# Altium schematic sheet IRIS1-DLB.SchDoc
size A3; SheetNumber: 1; SheetTotal: 1
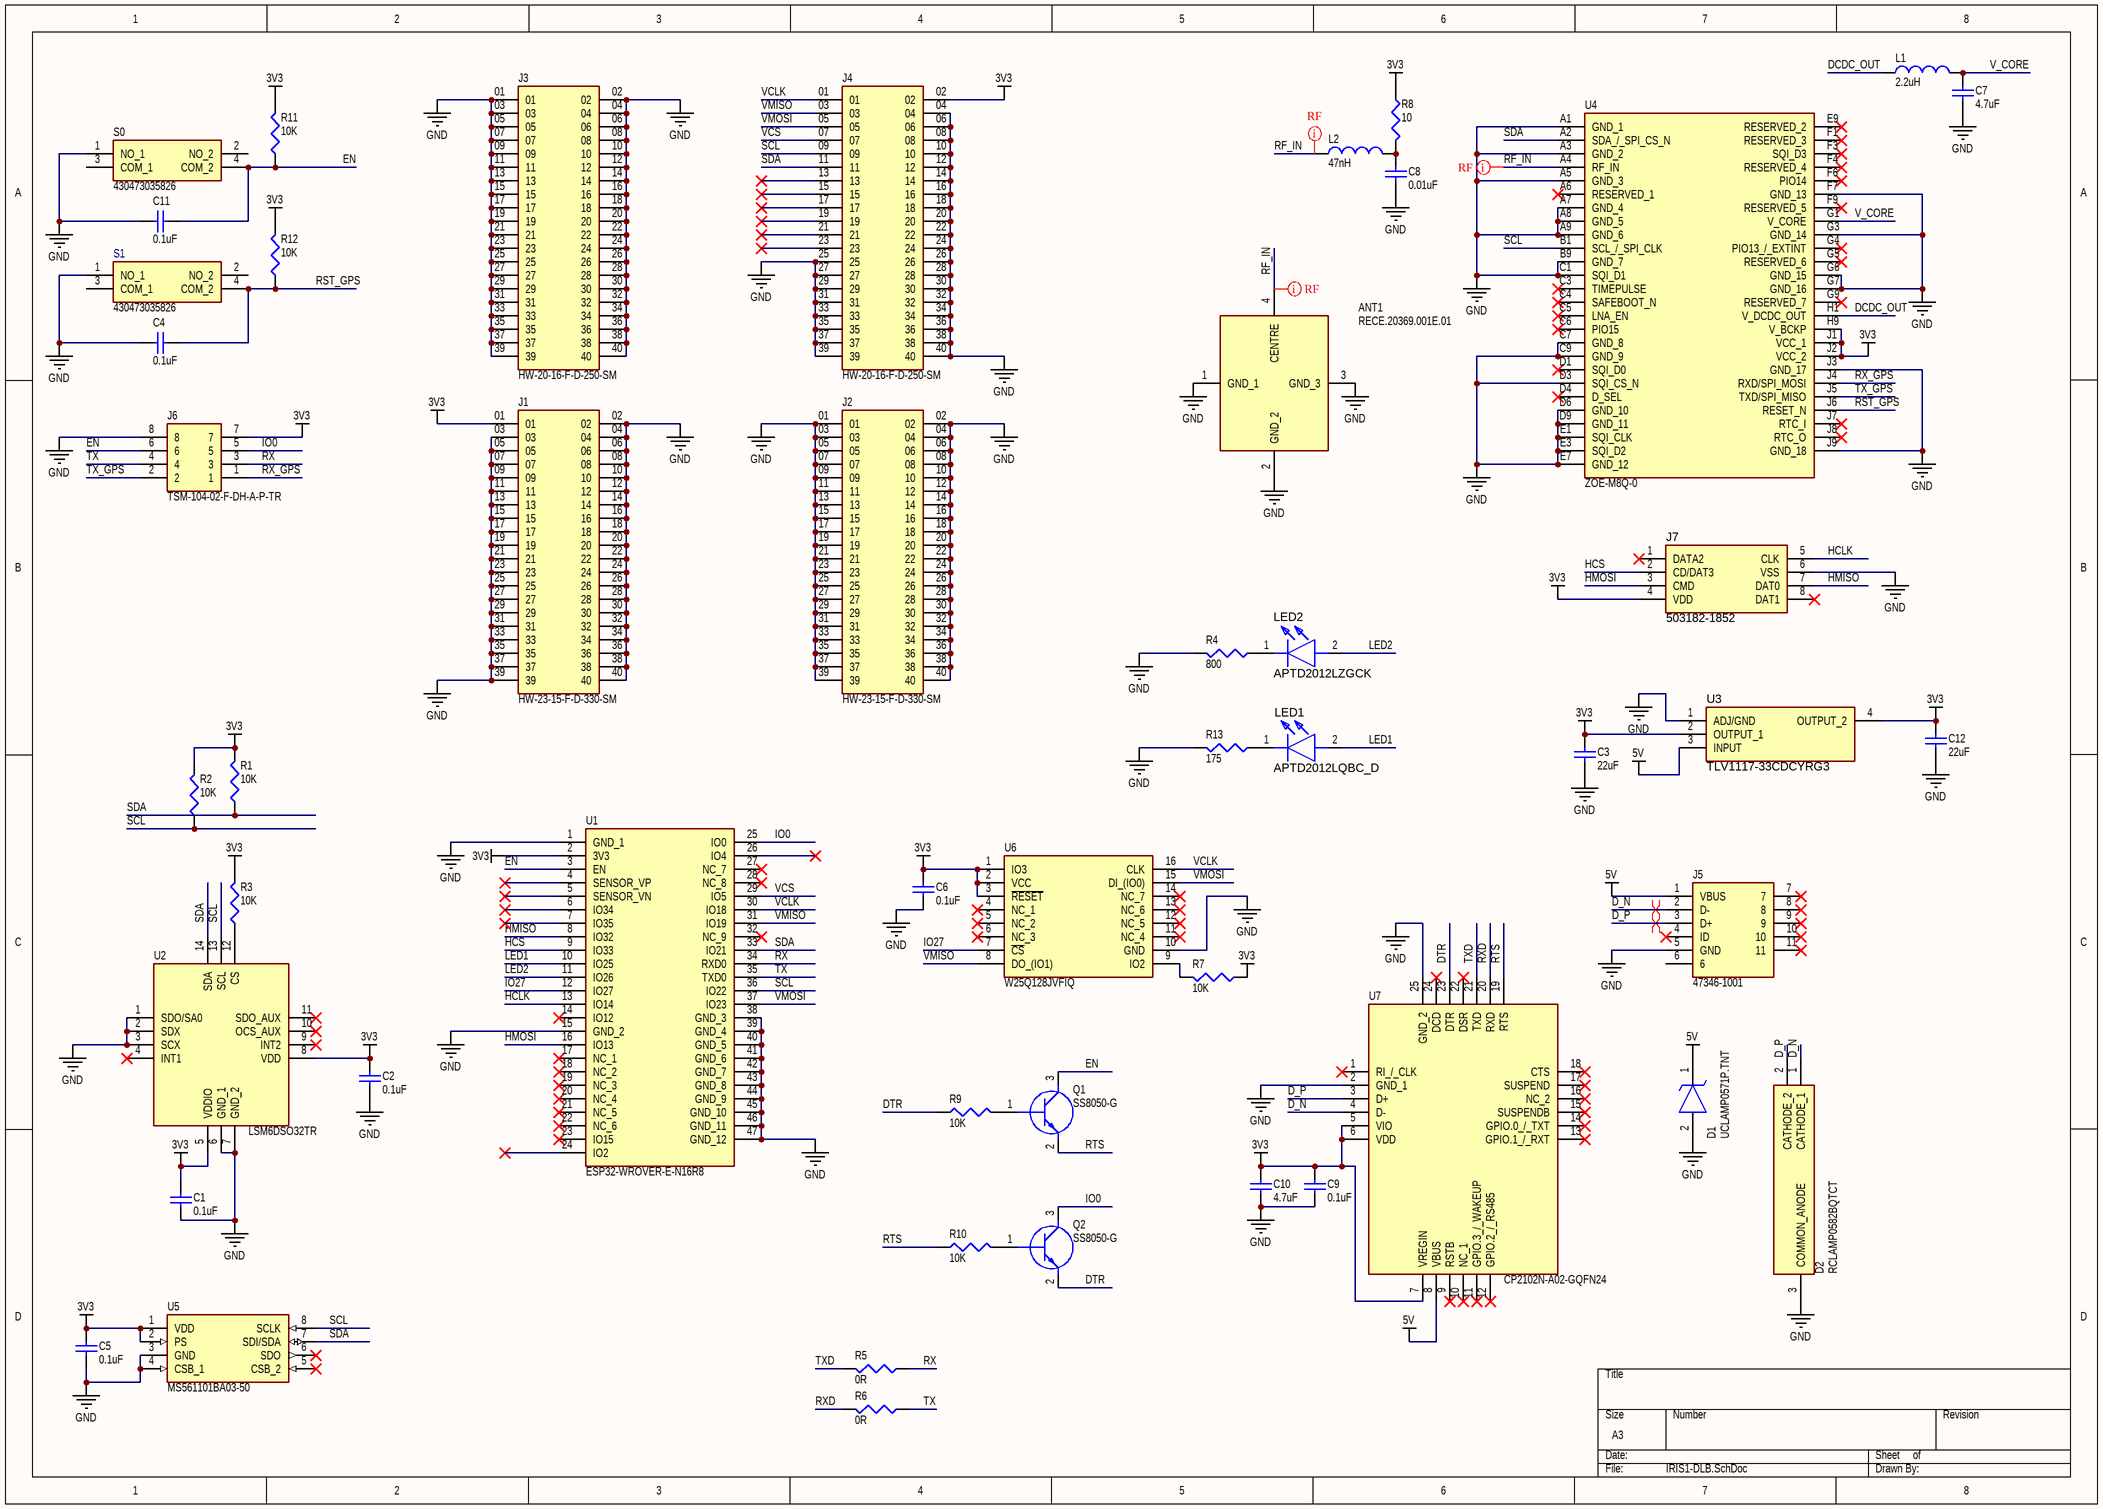
[diagram p0: IRIS1-DLB.SchDoc]

## Parts
ANT1  RECE.20369.001E.01  [RECE20369001E01]
C1  0.1uF  [1608[0603]]
C2  0.1uF  [1608[0603]]
C3  22uF  [1608[0603]]
C4  0.1uF  [1608[0603]]
C5  0.1uF  [1608[0603]]
C6  0.1uF  [1608[0603]]
C7  4.7uF  [1608[0603]]
C8  0.01uF  [1608[0603]]
C9  0.1uF  [1608[0603]]
C10  4.7uF  [1608[0603]]
C11  0.1uF  [1608[0603]]
C12  22uF  [1608[0603]]
D1  UCLAMP0571P.TNT  [DIOC1610X55N]
D2  RCLAMP0582BQTCT  [SOT50P160X90-3N]
J1  HW-23-15-F-D-330-SM  [SAMTEC_HW-20-16-F-D-250-SM]
J2  HW-23-15-F-D-330-SM  [SAMTEC_HW-20-16-F-D-250-SM]
J3  HW-20-16-F-D-250-SM  [SAMTEC_HW-20-16-F-D-250-SM]
J4  HW-20-16-F-D-250-SM  [SAMTEC_HW-20-16-F-D-250-SM]
J5  47346-1001  [473461001]
J6  TSM-104-02-F-DH-A-P-TR  [TSM-104-ZZ-YYY-DH-A-P-TR]
J7  503182-1852  [5031821852]
L1  2.2uH  [0402-A]
L2  47nH  [0402-A]
LED1  APTD2012LQBC_D  [LEDC2012X120N]
LED2  APTD2012LZGCK  [LEDC2012X105N]
Q1  SS8050-G  [SOT95P240X115-3N]
Q2  SS8050-G  [SOT95P240X115-3N]
R1  10K  [J1-0603]
R2  10K  [J1-0603]
R3  10K  [J1-0603]
R4  800  [J1-0603]
R5  0R  [J1-0603]
R6  0R  [J1-0603]
R7  10K  [J1-0603]
R8  10  [J1-0603]
R9  10K  [J1-0603]
R10  10K  [J1-0603]
R11  10K  [J1-0603]
R12  10K  [J1-0603]
R13  175  [J1-0603]
S0  430473035826  [430473035826]
S1  430473035826  [430473035826]
U1  ESP32-WROVER-E-N16R8  [ESP32WROVEREN16R8]
U2  LSM6DSO32TR  [LGA-14(2.5X3X0.86)]
U3  TLV1117-33CDCYRG3  [SOT230P700X180-4N]
U4  ZOE-M8Q-0  [ZOEM8Q0]
U5  MS561101BA03-50  [MS561101BA03-50]
U6  W25Q128JVFIQ  [SOIC127P1032X264-16N]
U7  CP2102N-A02-GQFN24  [QFN50P400X400X80-25N-D]

## Nets
3V3: C1.2 C2.2 C3.2 C5.2 C6.2 C9.2 C10.2 C12.2 J1.01 J4.02 J6.7 J7.4(VDD) R1.2 R2.2 R3.2 R7.1 R8.1 R11.2 R12.2 U1.2(3V3) U2.5(VDDIO) U2.8(VDD) U3.2(OUTPUT_1) U3.4(OUTPUT_2) U4.H9(V_BCKP) U4.J1(VCC_1) U4.J2(VCC_2) U5.1(VDD) U5.2(PS) U6.1(IO3) U6.2(VCC) U6.3(~{RESET}) U7.5(VIO) U7.6(VDD) U7.7(VREGIN)
5V: D1.1(K) J5.1(VBUS) U3.3(INPUT) U7.8(VBUS)
GND: ANT1.1(GND_1) ANT1.2(GND_2) ANT1.3(GND_3) C1.1 C2.1 C3.1 C4.1 C5.1 C6.1 C7.1 C8.1 C9.1 C10.1 C11.1 C12.1 D1.2(A) D2.3(COMMON_ANODE) J1.02 J1.03 J1.04 J1.05 J1.06 J1.07 J1.08 J1.09 J1.10 J1.11 J1.12 J1.13 J1.14 J1.15 J1.16 J1.17 J1.18 J1.19 J1.20 J1.21 J1.22 J1.23 J1.24 J1.25 J1.26 J1.27 J1.28 J1.29 J1.30 J1.31 J1.32 J1.33 J1.34 J1.35 J1.36 J1.37 J1.38 J1.39 J1.40 J2.01 J2.02 J2.03 J2.04 J2.05 J2.06 J2.07 J2.08 J2.09 J2.10 J2.11 J2.12 J2.13 J2.14 J2.15 J2.16 J2.17 J2.18 J2.19 J2.20 J2.21 J2.22 J2.23 J2.24 J2.25 J2.26 J2.27 J2.28 J2.29 J2.30 J2.31 J2.32 J2.33 J2.34 J2.35 J2.36 J2.37 J2.38 J2.39 J2.40 J3.01 J3.02 J3.03 J3.04 J3.05 J3.06 J3.07 J3.08 J3.09 J3.10 J3.11 J3.12 J3.13 J3.14 J3.15 J3.16 J3.17 J3.18 J3.19 J3.20 J3.21 J3.22 J3.23 J3.24 J3.25 J3.26 J3.27 J3.28 J3.29 J3.30 J3.31 J3.32 J3.33 J3.34 J3.35 J3.36 J3.37 J3.38 J3.39 J3.40 J4.04 J4.06 J4.08 J4.10 J4.12 J4.14 J4.16 J4.18 J4.20 J4.22 J4.24 J4.25 J4.26 J4.27 J4.28 J4.29 J4.30 J4.31 J4.32 J4.33 J4.34 J4.35 J4.36 J4.37 J4.38 J4.39 J4.40 J5.5(GND) J6.8 J7.6(VSS) R4.2 R13.2 S0.1(NO_1) S1.1(NO_1) U1.1(GND_1) U1.15(GND_2) U1.38(GND_3) U1.39(GND_4) U1.40(GND_5) U1.41(GND_6) U1.42(GND_7) U1.43(GND_8) U1.44(GND_9) U1.45(GND_10) U1.46(GND_11) U1.47(GND_12) U2.1(SDO/SA0) U2.2(SDX) U2.3(SCX) U2.6(GND_1) U2.7(GND_2) U3.1(ADJ/GND) U4.A1(GND_1) U4.A3(GND_2) U4.A5(GND_3) U4.A7(GND_4) U4.A8(GND_5) U4.A9(GND_6) U4.B9(GND_7) U4.C1(SQI_D1) U4.C7(GND_8) U4.C9(GND_9) U4.D3(SQI_CS_N) U4.D6(GND_10) U4.D9(GND_11) U4.E1(SQI_CLK) U4.E3(SQI_D2) U4.E7(GND_12) U4.F7(GND_13) U4.G3(GND_14) U4.G6(GND_15) U4.G7(GND_16) U4.J3(GND_17) U4.J9(GND_18) U5.3(GND) U5.4(CSB_1) U6.10(GND) U7.2(GND_1) U7.25(GND_2)
D_N: D2.1(CATHODE_1) J5.2(D-) U7.4(D-)
D_P: D2.2(CATHODE_2) J5.3(D+) U7.3(D+)
DCDC_OUT: L1.1 U4.H1(V_DCDC_OUT)
DTR: Q2.2(E) R9.1 U7.23(DTR)
EN: C11.2 J6.6 Q1.3(C) R11.1 S0.4(COM_2) U1.3(EN)
HCLK: J7.5(CLK) U1.13(IO14)
HCS: J7.2(CD/DAT3) U1.9(IO33)
HMISO: J7.7(DAT0) U1.8(IO32)
HMOSI: J7.3(CMD) U1.16(IO13)
IO0: J6.5 Q2.3(C) U1.25(IO0)
IO27: U1.12(IO27) U6.7(~{CS})
LED1: LED1.2(A) U1.10(IO25)
LED2: LED2.2(A) U1.11(IO26)
RF_IN: ANT1.4(CENTRE) L2.1 U4.A4(RF_IN)
RST_GPS: C4.2 R12.1 S1.4(COM_2) U4.J6(RESET_N)
RTS: Q1.2(E) R10.1 U7.19(RTS)
RX: J6.3 R5.1 U1.34(RXD0)
RX_GPS: J6.1 U4.J4(RXD/SPI_MOSI)
RXD: R6.2 U7.20(RXD)
SCL: J4.09 R2.1 U1.36(IO22) U2.13(SCL) U4.B1(SCL_/_SPI_CLK) U5.8(SCLK)
SDA: J4.11 R1.1 U1.33(IO21) U2.14(SDA) U4.A2(SDA_/_SPI_CS_N) U5.7(SDI/SDA)
TX: J6.4 R6.1 U1.35(TXD0)
TX_GPS: J6.2 U4.J5(TXD/SPI_MISO)
TXD: R5.2 U7.21(TXD)
V_CORE: C7.2 L1.2 U4.G1(V_CORE)
VCLK: J4.01 U1.30(IO18) U6.16(CLK)
VCS: J4.07 U1.29(IO5)
VMISO: J4.03 U1.31(IO19) U6.8(DO_(IO1))
VMOSI: J4.05 U1.37(IO23) U6.15(DI_(IO0))
NetC8_2: C8.2 L2.2 R8.2
NetLED1_1: LED1.1(K) R13.1
NetLED2_1: LED2.1(K) R4.1
NetQ1_1: Q1.1(B) R9.2
NetQ2_1: Q2.1(B) R10.2
NetR3_1: R3.1 U2.12(CS)
NetR7_2: R7.2 U6.9(IO2)

Not connected (* = marked no-connect by the designer): J4 13* 15* 17* 19* 21* 23*; J5 4(ID)* 6 7* 8* 9* 10* 11*; J7 1(DATA2)* 8(DAT1)*; S0 2(NO_2) 3(COM_1); S1 2(NO_2) 3(COM_1); U1 4(SENSOR_VP)* 5(SENSOR_VN)* 6(IO34)* 7(IO35)* 14(IO12)* 17(NC_1)* 18(NC_2)* 19(NC_3)* 20(NC_4)* 21(NC_5)* 22(NC_6)* 23(IO15)* 24(IO2)* 26(IO4)* 27(NC_7)* 28(NC_8)* 32(NC_9)*; U2 4(INT1)* 9(INT2)* 10(OCS_AUX)* 11(SDO_AUX)*; U4 A6(RESERVED_1)* C3(TIMEPULSE)* C4(SAFEBOOT_N)* C5(LNA_EN)* C6(PIO15)* D1(SQI_D0)* D4(D_SEL)* E9(RESERVED_2)* F1(RESERVED_3)* F3(SQI_D3)* F4(RESERVED_4)* F6(PIO14)* F9(RESERVED_5)* G4(PIO13_/_EXTINT)* G5(RESERVED_6)* G9(RESERVED_7)* J7(RTC_I)* J8(RTC_O)*; U5 5(CSB_2)* 6(SDO)*; U6 4(NC_1)* 5(NC_2)* 6(NC_3)* 11(NC_4)* 12(NC_5)* 13(NC_6)* 14(NC_7)*; U7 1(RI_/_CLK)* 9(RSTB)* 10(NC_1)* 11(GPIO.3_/_WAKEUP)* 12(GPIO.2_/_RS485)* 13(GPIO.1_/_RXT)* 14(GPIO.0_/_TXT)* 15(SUSPENDB)* 16(NC_2)* 17(SUSPEND)* 18(CTS)* 22(DSR)* 24(DCD)*

## Layout directives
differential pair: D_N, D_P
net class RF: RF_IN

## Library data of the parts
ANT1 = RECE.20369.001E.01: Antenna; Manufacturer_Name: Taoglas; Datasheet Link: https://cdn.taoglas.com/datasheets/RECE.20369.001E.01.pdf; Height: 1.05mm; Manufacturer_Part_Number: RECE.20369.001E.01; Mouser Part Number: 960-RECE.20369001E01; Mouser Price/Stock: https://www.mouser.co.uk/ProductDetail/Taoglas/RECE.20369.001E.01?qs=DRkmTr78QATTXEmgGw9Tjg%3D%3D
C1 C2 C4-C6 C9 C11 = Cap: Capacitor; Published: 8-Jun-2000; LatestRevisionDate: 17-Jul-2002; LatestRevisionNote: Re-released for DXP Platform.; PackageReference: RAD-0.3; Publisher: Altium Limited; PackageDescription: Radial Cap, Thru-Hole; 2 Leads; 0.3 in Pin Spacing; Value: 0.1uF
C3 C7 C8 C10 C12 = Cap: Capacitor; Value: 0.1uF; Published: 8-Jun-2000; LatestRevisionDate: 17-Jul-2002; LatestRevisionNote: Re-released for DXP Platform.; PackageReference: RAD-0.3; Publisher: Altium Limited; PackageDescription: Radial Cap, Thru-Hole; 2 Leads; 0.3 in Pin Spacing
D1 = UCLAMP0571P.TNT: TVS Diode (Uni-directional); Manufacturer_Name: SEMTECH; Datasheet Link: https://www.mouser.com/datasheet/2/761/uClampxx71P-1360280.pdf; Height: 0.55mm; Manufacturer_Part_Number: UCLAMP0571P.TNT; Mouser Part Number: 947-UCLAMP0571P.TNT; Mouser Price/Stock: https://www.mouser.co.uk/ProductDetail/Semtech/UCLAMP0571PTNT?qs=rBWM4%252BvDhIdABRCK070WwQ%3D%3D; Arrow Part Number: UCLAMP0571P.TNT; Arrow Price/Stock: https://www.arrow.com/en/products/uclamp0571p.tnt/semtech?region=europe
D2 = RCLAMP0582BQTCT: TVS Diode (Uni-directional); Manufacturer_Name: SEMTECH; Datasheet Link: https://datasheet.datasheetarchive.com/originals/distributors/Datasheets-DGA21/1852579.pdf; Height: 0.9mm; Manufacturer_Part_Number: RCLAMP0582BQTCT; Mouser Part Number: 947-RCLAMP0582BQTCT; Mouser Price/Stock: https://www.mouser.co.uk/ProductDetail/Semtech/RCLAMP0582BQTCT?qs=rBWM4%252BvDhIdyuNQteOG89g%3D%3D; Arrow Part Number: RCLAMP0582BQTCT; Arrow Price/Stock: https://www.arrow.com/en/products/rclamp0582bqtct/semtech?region=nac
J1 J2 = HW-20-XX-XX-D-XXX-XXX: MF: Samtec; MP: HW-20-08-G-D-350-100; Check_prices: https://www.snapeda.com/parts/HW-20-08-G-D-350-100/Samtec/view-part/?ref=eda; Value: *; Availability: Not in stock; Price: None; Package: None; SnapEDA_Link: https://www.snapeda.com/parts/HW-20-08-G-D-350-100/Samtec/view-part/?ref=snap
J5 = 47346-1001: Connector; Manufacturer_Name: Molex; Datasheet Link: http://www.molex.com/webdocs/datasheets/pdf/en-us/0473461001_IO_CONNECTORS.pdf; Height: 2.94mm; Manufacturer_Part_Number: 47346-1001; Mouser Part Number: 538-47346-1001; Mouser Price/Stock: https://www.mouser.co.uk/ProductDetail/Molex/47346-1001?qs=yd8XiKYcH9muPqUKe4E0Dw%3D%3D; Arrow Part Number: 47346-1001; Arrow Price/Stock: https://www.arrow.com/en/products/47346-1001/molex?region=nac
J6 = TSM-104-02-F-DH-A-P-TR: Connector; Manufacturer_Name: SAMTEC; Datasheet Link: http://suddendocs.samtec.com/prints/tsm-1xx-xx-xxx-xx-xx-xxx-xx-mkt1.pdf; Manufacturer_Part_Number: TSM-104-02-F-DH-A-P-TR
J7 = 503182-1852: Connector; Manufacturer_Name: Molex; Datasheet Link: https://www.molex.com/pdm_docs/sd/5031821852_sd.pdf; Manufacturer_Part_Number: 503182-1852; Mouser Part Number: 538-503182-1852; Mouser Price/Stock: https://www.mouser.co.uk/ProductDetail/Molex/503182-1852?qs=s7UCm7gO1bZmpyAhCKZ26g%3D%3D
L1 L2 = Inductor: Code_IEC: 1005; Value: 10mH; Published: 8-Jun-2000; LatestRevisionDate: 29-May-2009; LatestRevisionNote: IPC-7351 Footprint Added.; PackageReference: 0402-A; Publisher: Altium Limited; PackageDescription: Chip Inductor; Code_JEITA: 0402
LED1 = APTD2012LQBC_D: LED; Manufacturer_Name: Kingbright; Manufacturer_Part_Number: APTD2012LQBC/D; Datasheet Link: https://componentsearchengine.com/Datasheets/1/APTD2012LQBC_D.pdf; Height: 1.2mm; Mouser Part Number: 604-APTD2012LQBCD; Mouser Price/Stock: https://www.mouser.co.uk/ProductDetail/Kingbright/APTD2012LQBC-D?qs=AQlKX63v8RvDGqprk6aUCg%3D%3D; Arrow Part Number: APTD2012LQBC/D; Arrow Price/Stock: https://www.arrow.com/en/products/aptd2012lqbcd/kingbright
LED2 = APTD2012LZGCK: LED; Manufacturer_Name: Kingbright; Datasheet Link: http://www.kingbrightusa.com/images/catalog/SPEC/APTD2012LZGCK.pdf; Height: 1.05mm; Manufacturer_Part_Number: APTD2012LZGCK; Mouser Part Number: 604-APTD2012LZGCK; Mouser Price/Stock: https://www.mouser.co.uk/ProductDetail/Kingbright/APTD2012LZGCK?qs=AQlKX63v8RvUnlqpSGhMeA%3D%3D; Arrow Part Number: APTD2012LZGCK; Arrow Price/Stock: https://www.arrow.com/en/products/aptd2012lzgck/kingbright?region=nac
Q1 Q2 = SS8050-G: Transistor BJT NPN; Manufacturer_Name: Comchip Technology; Datasheet Link: https://datasheet.datasheetarchive.com/originals/distributors/DKDS-12/229454.pdf; Height: 1.15mm; Manufacturer_Part_Number: SS8050-G; Mouser Part Number: 750-SS8050-G; Mouser Price/Stock: https://www.mouser.co.uk/ProductDetail/Comchip-Technology/SS8050-G?qs=LLUE9lz1YbcHg%252BWLMAtcrQ%3D%3D; Arrow Part Number: SS8050-G; Arrow Price/Stock: https://www.arrow.com/en/products/ss8050-g/comchip-technology?region=nac
R1-R13 = Res3: Resistor; Value: 1K; Published: 8-Jun-2000; LatestRevisionDate: 29-May-2009; LatestRevisionNote: IPC-7351 Footprint Added.; PackageReference: J1-0603; Publisher: Altium Limited; PackageDescription: Chip Resistor
S0 S1 = 430473035826: Switch; Manufacturer_Name: Wurth Elektronik; Datasheet Link: https://componentsearchengine.com/Datasheets/2/430473035826.pdf; Height: 3.7mm; Manufacturer_Part_Number: 430473035826; Mouser Part Number: 710-430473035826; Mouser Price/Stock: https://www.mouser.co.uk/ProductDetail/Wurth-Elektronik/430473035826?qs=wr8lucFkNMX7XPiy2wLoYQ%3D%3D
U1 = ESP32-WROVER-E-N16R8: Integrated Circuit; Manufacturer_Name: Espressif Systems; Datasheet Link: https://www.espressif.com/sites/default/files/documentation/esp32-wrover-e_esp32-wrover-ie_datasheet_en.pdf; Height: 3.45mm; Manufacturer_Part_Number: ESP32-WROVER-E-N16R8; Mouser Part Number: 356-ESP32WRVE22864PC; Mouser Price/Stock: https://www.mouser.co.uk/ProductDetail/Espressif-Systems/ESP32-WROVER-E-N16R8?qs=Li%252BoUPsLEnsfUZ%252By2eNF6g%3D%3D
U2 = LSM6DSOTR: Accelerometer; Manufacturer_Name: STMicroelectronics; Datasheet Link: https://www.st.com/resource/en/datasheet/lsm6dso.pdf; Manufacturer_Part_Number: LSM6DSOTR; Mouser Part Number: 511-LSM6DSOTR; Mouser Price/Stock: https://www.mouser.co.uk/ProductDetail/STMicroelectronics/LSM6DSOTR?qs=lc2O%252BfHJPVbD197C5c7oNw%3D%3D; Arrow Part Number: LSM6DSOTR; Arrow Price/Stock: https://www.arrow.com/en/products/lsm6dsotr/stmicroelectronics
U3 = TLV1117-33CDCYRG3: Integrated Circuit; Manufacturer_Name: Texas Instruments; Datasheet Link: https://www.ti.com/lit/gpn/tlv1117; Height: 1.8mm; Manufacturer_Part_Number: TLV1117-33CDCYRG3; Mouser Part Number: 595-TLV111733CDCYRG3; Mouser Price/Stock: https://www.mouser.co.uk/ProductDetail/Texas-Instruments/TLV1117-33CDCYRG3?qs=YdQ7Kj7W0bz83qTpELrgpA%3D%3D; Arrow Part Number: TLV1117-33CDCYRG3; Arrow Price/Stock: https://www.arrow.com/en/products/tlv1117-33cdcyrg3/texas-instruments?region=nac
U4 = ZOE-M8Q-0: Integrated Circuit; Manufacturer_Name: U-Blox; Datasheet Link: https://www.u-blox.com/sites/default/files/ZOE-M8_DataSheet_%28UBX-16008094%29-3.pdf; Height: 1.165mm; Manufacturer_Part_Number: ZOE-M8Q-0; Mouser Part Number: 377-ZOE-M8Q-0; Mouser Price/Stock: https://www.mouser.co.uk/ProductDetail/u-blox/ZOE-M8Q-0?qs=zW32dvEIR3tuFb40SAB5GQ%3D%3D
U5 = MS561101BA03-50: Integrated Circuit; Manufacturer_Name: TE Connectivity; Datasheet Link: http://www.te.com/usa-en/search.html?q=ms5611&source=header; Manufacturer_Part_Number: MS561101BA03-50; Mouser Part Number: 824-MS561101BA03-50; Mouser Price/Stock: https://www.mouser.co.uk/ProductDetail/Measurement-Specialties/MS561101BA03-50?qs=%252BgKeJhng5iV%252BnCz6Qd5iDw%3D%3D; Arrow Part Number: MS561101BA03-50; Arrow Price/Stock: https://www.arrow.com/en/products/ms561101ba03-50/te-connectivity?region=europe
U6 = W25Q128JVFIQ: Integrated Circuit; Manufacturer_Name: Winbond; Datasheet Link: https://www.winbond.com/hq/search-resource-file.jsp?partNo=W25Q128JVFIQ&type=datasheet; Height: 2.64mm; Manufacturer_Part_Number: W25Q128JVFIQ; Mouser Part Number: 454-W25Q128JVFIQ; Mouser Price/Stock: https://www.mouser.co.uk/ProductDetail/Winbond/W25Q128JVFIQ?qs=qSfuJ%252Bfl%2Fd5tMgdyd2Kaog%3D%3D; Arrow Part Number: W25Q128JVFIQ; Arrow Price/Stock: https://www.arrow.com/en/products/w25q128jvfiq/winbond-electronics?region=nac
U7 = CP2102N-A02-GQFN24: Integrated Circuit; Manufacturer_Name: Silicon Labs; Datasheet Link: https://componentsearchengine.com/Datasheets/1/CP2102N-A02-GQFN24.pdf; Height: 0.8mm; Manufacturer_Part_Number: CP2102N-A02-GQFN24; Mouser Part Number: 634-CP2102NA02GQFN24; Mouser Price/Stock: https://www.mouser.co.uk/ProductDetail/Silicon-Labs/CP2102N-A02-GQFN24?qs=u16ybLDytRYKabtL%2FE7DZA%3D%3D; Arrow Part Number: CP2102N-A02-GQFN24; Arrow Price/Stock: https://www.arrow.com/en/products/cp2102n-a02-gqfn24/silicon-labs
J3 J4 = HW-20-16-F-D-250-SM: MP: HW-20-16-F-D-250-SM; Price: None; Package: None; Value: *; Availability: Unavailable